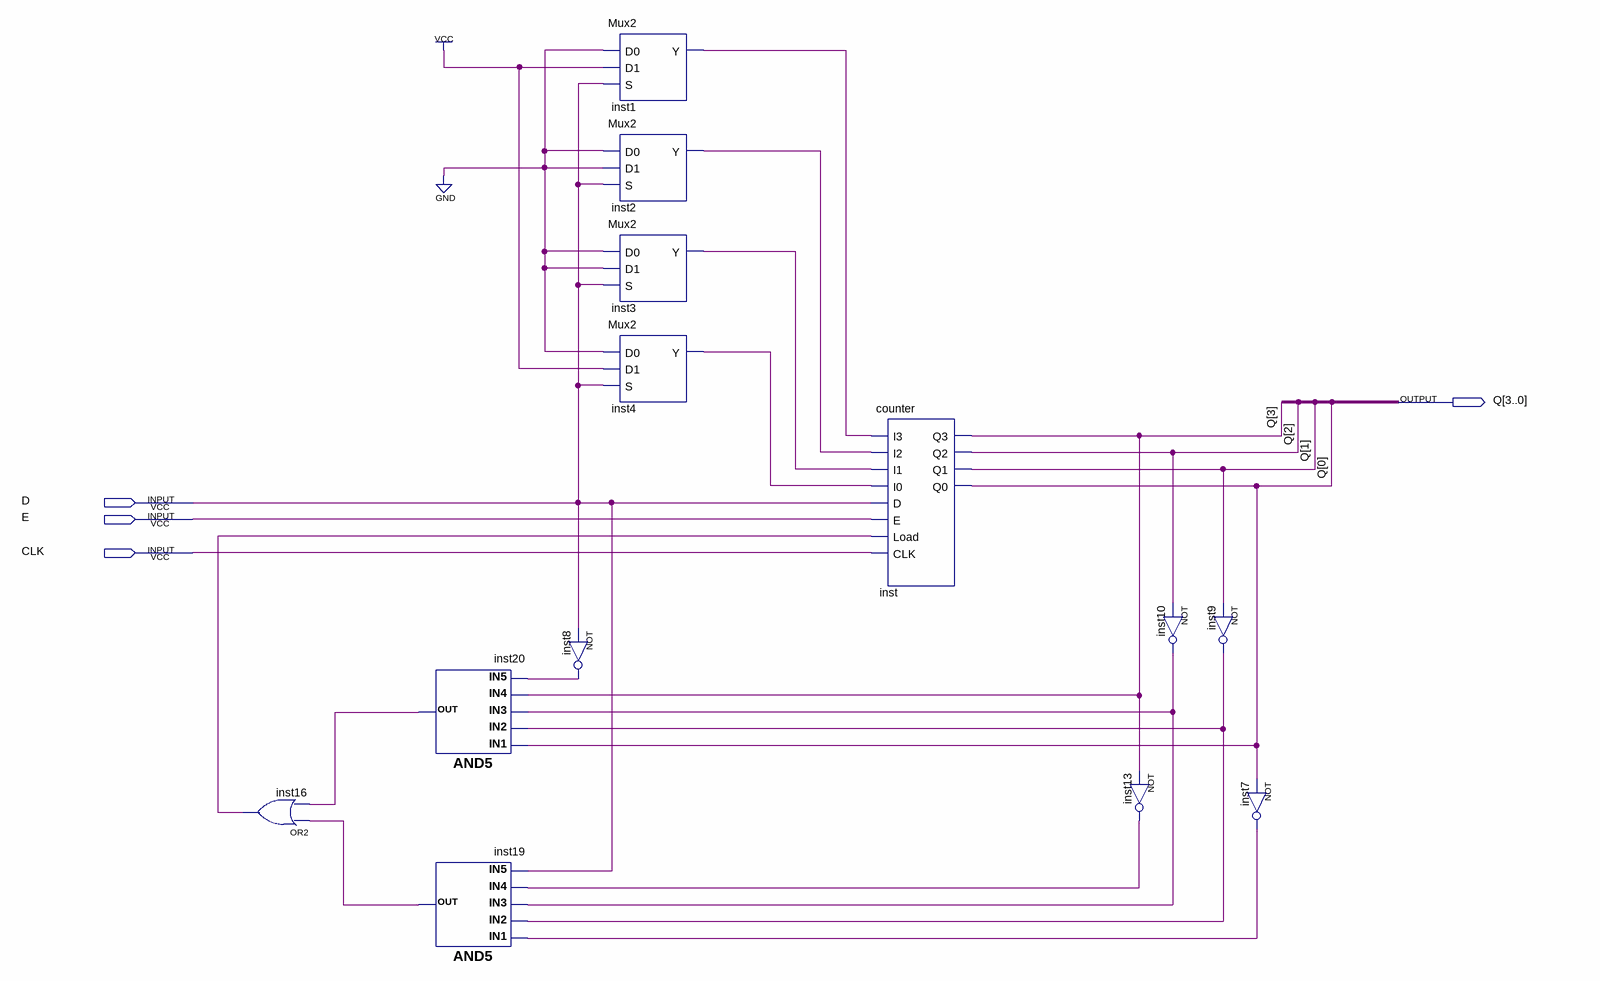
[diagram p0: schematic sheet]
// Quartus schematic BCDCounter.bdf as structural Verilog: 13 symbols, 4 pins
module BCDCounter (
  input  D,
  input  E,
  input  CLK,
  output [3:0] Q
);

  wire inst1_y, inst2_y, inst3_y, inst4_y, inst7_out, inst8_out, inst9_out, inst10_out, inst13_out,
       inst16_out, inst19_out, inst20_out;

  or inst16 (inst16_out, inst19_out, inst20_out);
  and inst20 (inst20_out, Q[0], inst9_out, inst10_out, Q[3], inst8_out);
  and inst19 (inst19_out, inst7_out, inst9_out, inst10_out, inst13_out, D);
  not inst8 (inst8_out, D);
  Mux2 inst1 (.D0(1'b0), .D1(1'b1), .S(D), .Y(inst1_y));
  Mux2 inst2 (.D0(1'b0), .D1(1'b0), .S(D), .Y(inst2_y));
  Mux2 inst3 (.D0(1'b0), .D1(1'b0), .S(D), .Y(inst3_y));
  Mux2 inst4 (.D0(1'b0), .D1(1'b1), .S(D), .Y(inst4_y));
  counter inst (
    .I3(inst1_y), .I2(inst2_y), .I1(inst3_y), .I0(inst4_y), .D(D), .E(E), .Load(inst16_out), .CLK(CLK),
    .Q3(Q[3]), .Q2(Q[2]), .Q1(Q[1]), .Q0(Q[0]));
  not inst13 (inst13_out, Q[3]);
  not inst10 (inst10_out, Q[2]);
  not inst9 (inst9_out, Q[1]);
  not inst7 (inst7_out, Q[0]);
endmodule
